# EAGLE board EEZ DIB DCP505 r1B2 (EAGLE 7.2.0), part 1 of 2
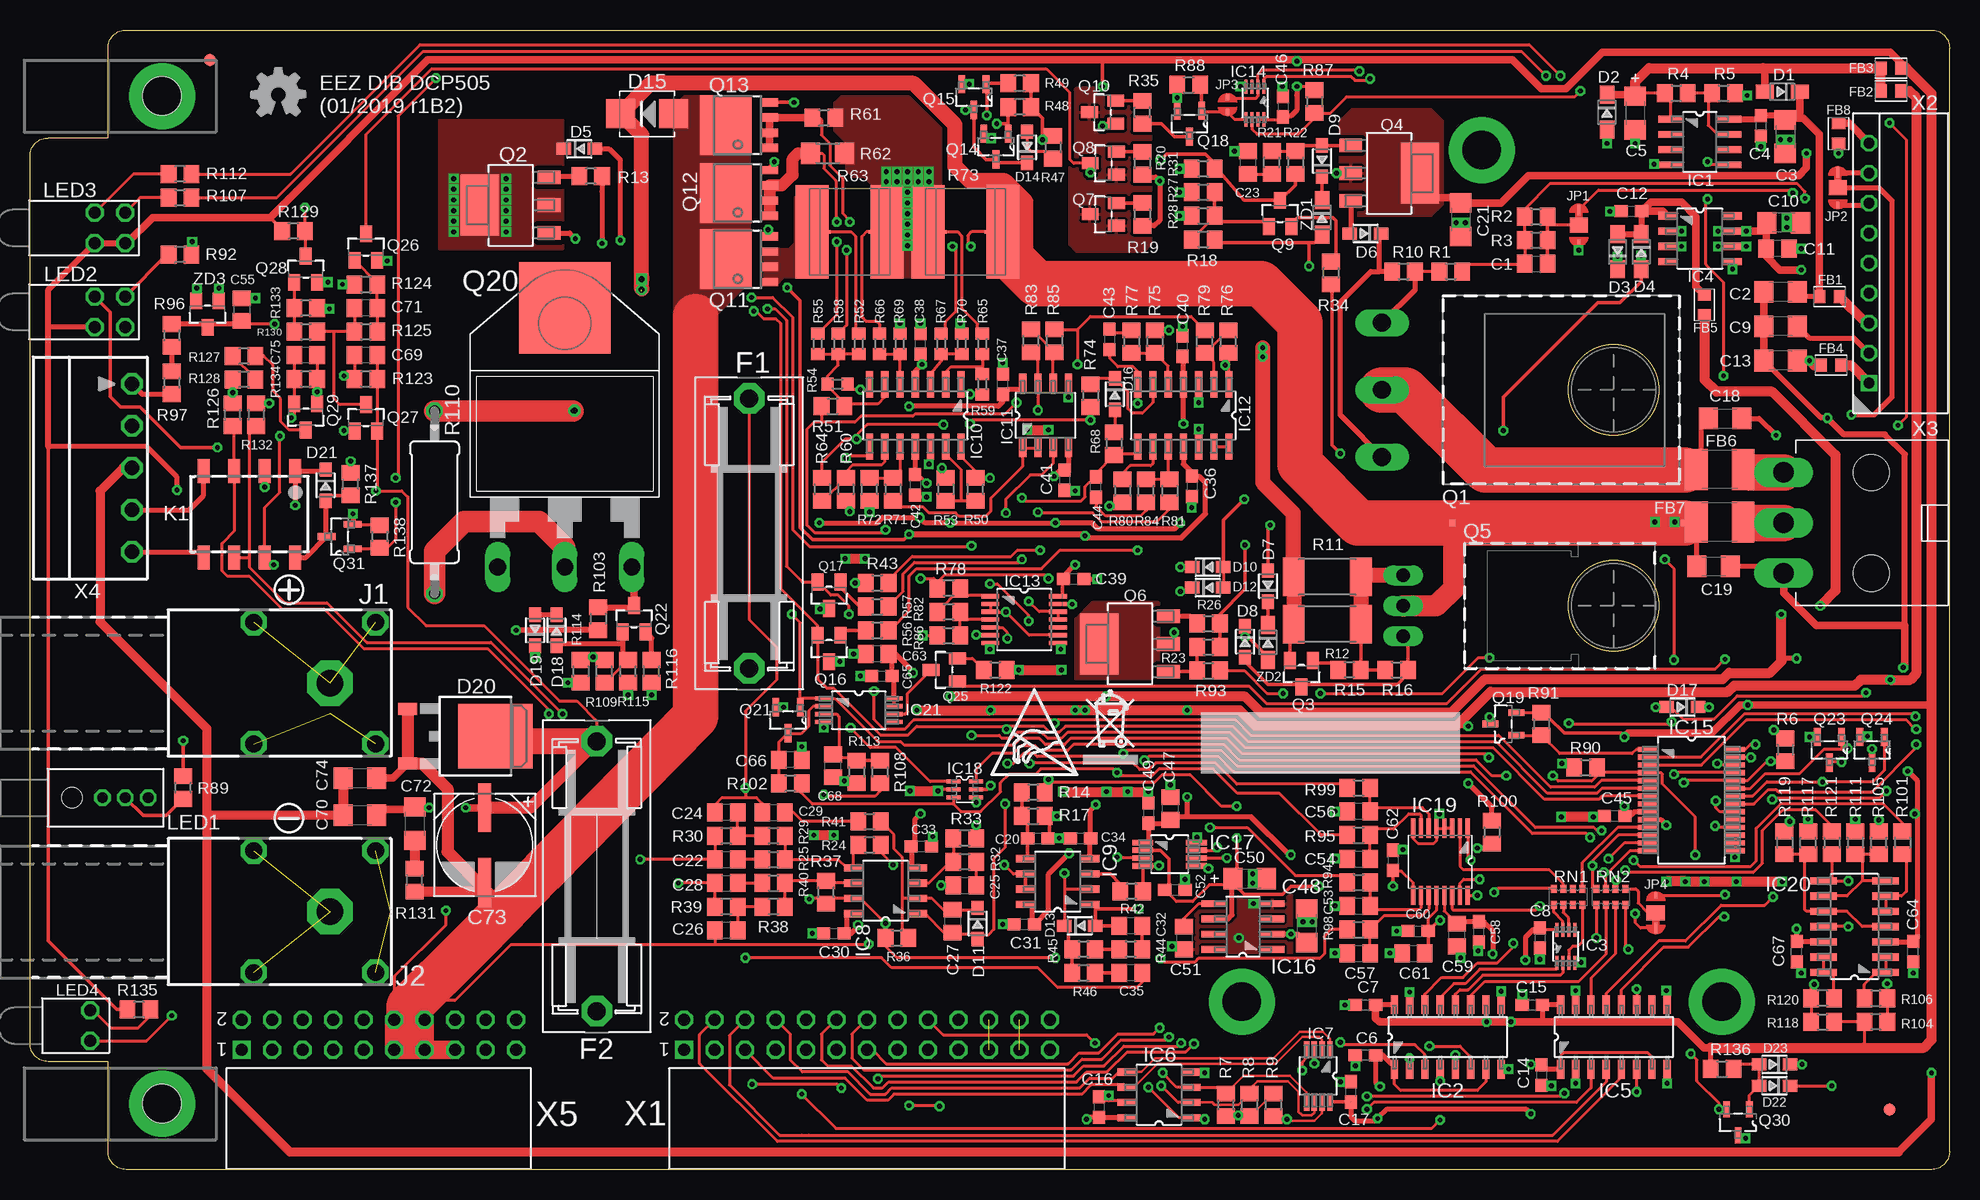
[diagram p6: board, top side]
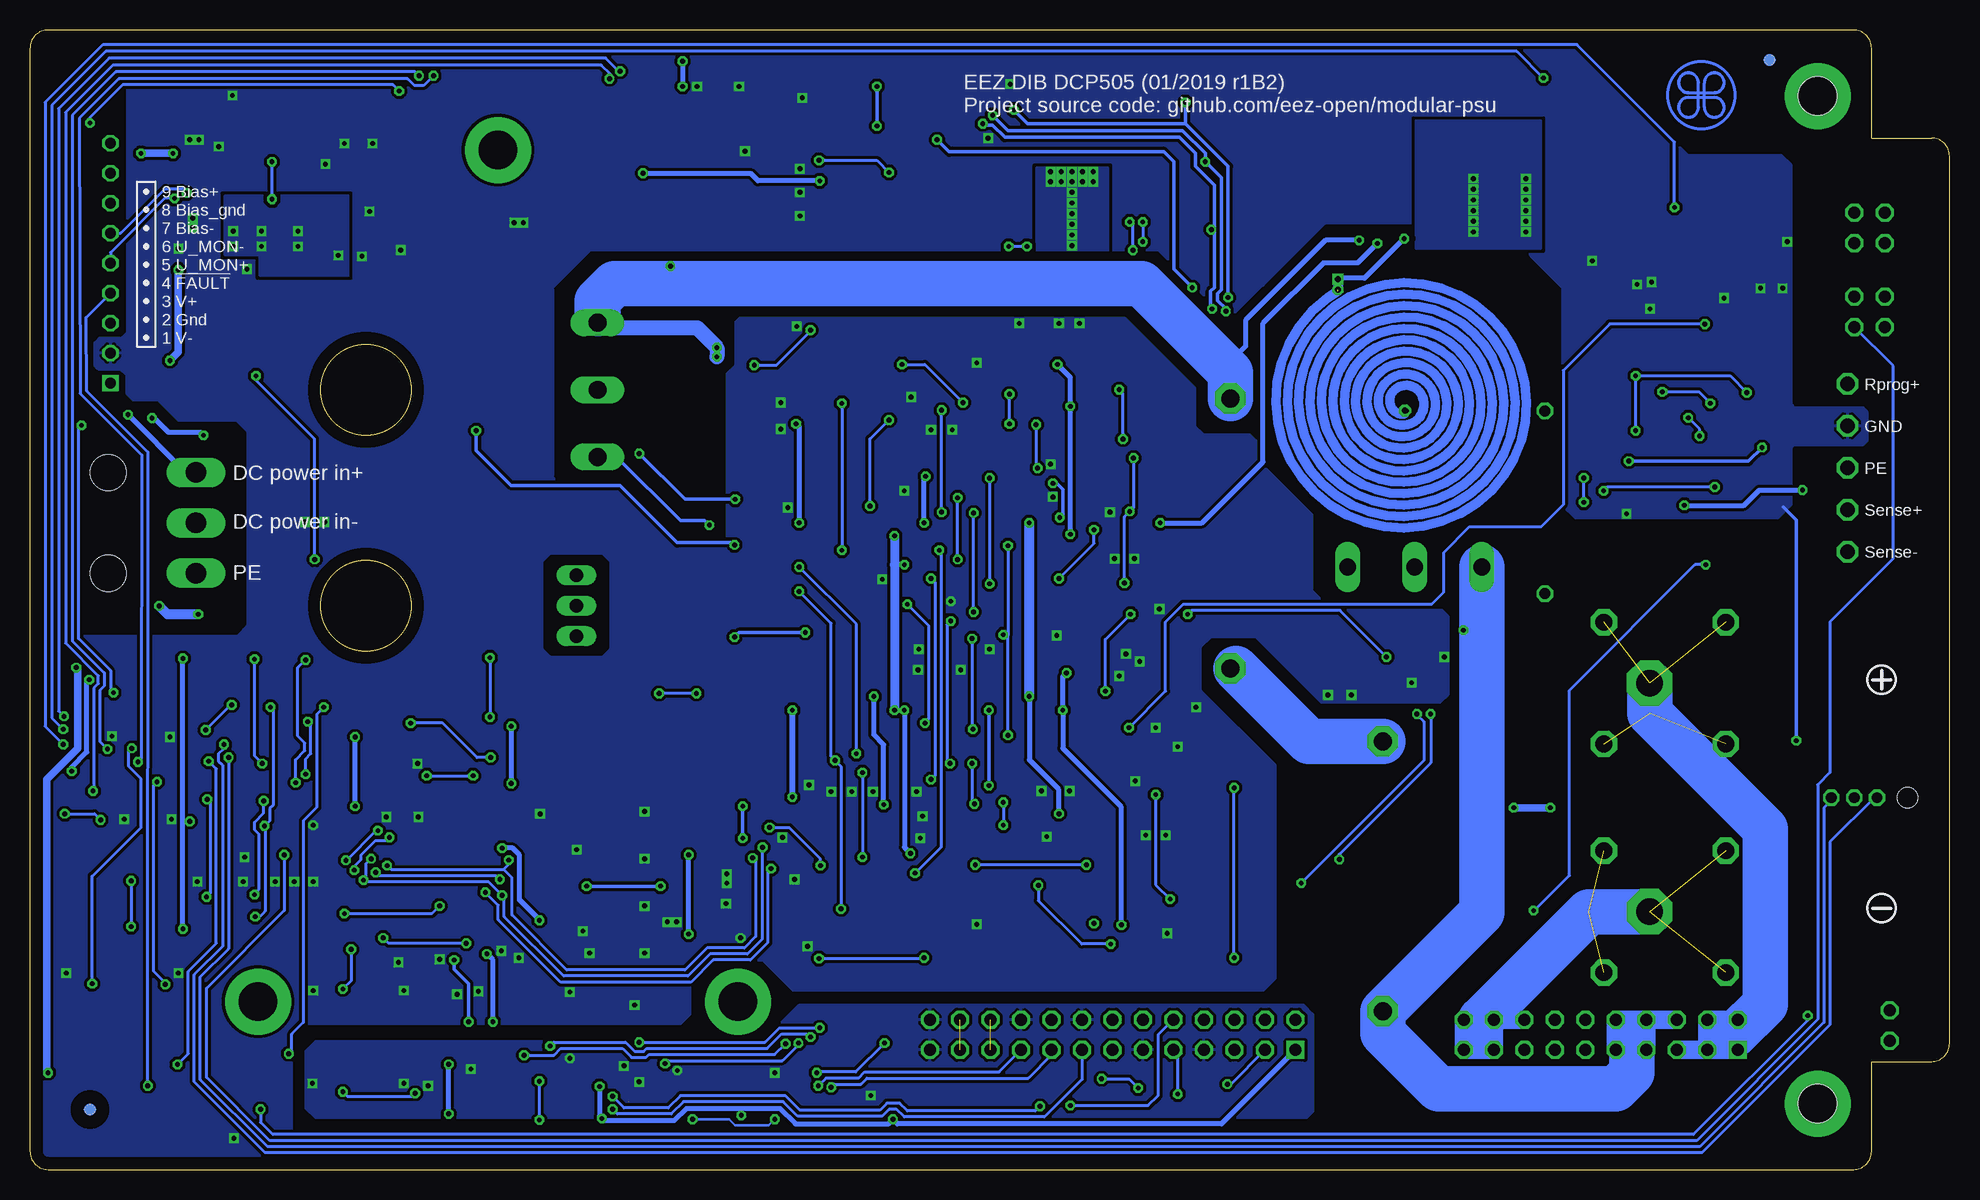
[diagram p7: board, bottom side, seen from below]

Size 160 x 95 mm. Coordinates in mm from the lower left corner, seen from the top.
Outline: 8,95 158.5,95 arc-90 160,93.5 160,1.5 arc-90 158.5,0 8,0 arc-90 6.5,1.5 6.5,9 1.5,9 arc-90 0,10.5 0,84.5 arc-90 1.5,86 6.5,86 6.5,93.5 arc-90 8,95
Outline: circle at 132,47 radius 3.75
Outline: circle at 132,65 radius 3.75
Copper layers (1*16): Top 0.035mm / dielectric 1.5mm / Bottom 0.035mm
Design rules "default *": minimum track width 6mil, minimum drill 0.3mm, track to track 6mil, track to pad 6mil, pad to pad 6mil, via to via 6mil, smd to smd 6mil, copper to edge 40mil, drill to drill 8mil, minimum pad ring 4mil, minimum via ring 8mil, stop-mask expansion 2.5mil, vias tented up to drill 1mm, thermal gap 8mil
Net classes: 0 default: width 0.203 mm, drill 0.3 mm, clearance 0.203 mm; 1 lvds: width 0.152 mm, drill 0.3 mm, clearance 0.152 mm to class 0, clearance 0.152 mm; 2 gnd: width 0.254 mm, drill 0.584 mm, clearance 0.254 mm

## Footprints (pad centres in the part's own frame; a part is rotated, then mirrored left to right if it is on the bottom)
C0805 = smd 1.3 x 1.5: 1 -0.95,0; 2 0.95,0
C1206 = smd 1.6 x 1.8: 1 -1.4,0; 2 1.4,0
C0603 = smd 1.1 x 1: 1 -0.85,0; 2 0.85,0
EC1206 = smd 1.6 x 1.8: + -1.4,0; - 1.4,0
CAPAE830X1050N = smd 4.064 x 1.092: + -3.124,0; - 3.124,0
SOD323-W = smd 1.5 x 1.2: A 1.45,0; C -1.45,0
SOD323-R = smd 1.2 x 1: A 1.3,0; C -1.3,0
SMB = smd 2.4 x 2.4: A 2.2,0; C -2.2,0
TO252-L = smd 1 x 1.6: 1 -2.28,-6.07; 2 2.28,-6.07 | smd 5.4 x 6.2: 3 0,1.23
ZH32 = drill 1.5 pad 2.54 octagon: 1 -11.25,0; 2 11.25,0
BEAD0603 = smd 1 x 1.1: P$1 -0.85,0; P$2 0.85,0
L1812 = smd 1.9 x 3.4: 1 -1.95,0; 2 1.95,0
FIDUCIAL_DUAL = smd 1.016 x 1.016 bottom: B 0,0 | smd 1.016 x 1.016: T 0,0
SOIC127P600X175-8N = smd 1.981 x 0.559: 1 -2.464,1.905; 2 -2.464,0.635; 3 -2.464,-0.635; 4 -2.464,-1.905; 5 2.464,-1.905; 6 2.464,-0.635; 7 2.464,0.635; 8 2.464,1.905
SOIC-16 = smd 1.549 x 0.61: 1 -2.692,4.445; 2 -2.692,3.175; 3 -2.692,1.905; 4 -2.692,0.635; 5 -2.692,-0.635; 6 -2.692,-1.905; 7 -2.692,-3.175; 8 -2.692,-4.445; 9 2.692,-4.445; 10 2.692,-3.175; 11 2.692,-1.905; 12 2.692,-0.635; 13 2.692,0.635; 14 2.692,1.905; 15 2.692,3.175; 16 2.692,4.445
DCU8 = smd 1.168 x 0.254: 1 -1.372,0.75; 2 -1.372,0.25; 3 -1.372,-0.25; 4 -1.372,-0.75; 5 1.372,-0.75; 6 1.372,-0.25; 7 1.372,0.25; 8 1.372,0.75
SOIC127P600X173-8N = smd 1.55 x 0.6: 1 -2.7,1.9; 2 -2.7,0.63; 3 -2.7,-0.64; 4 -2.7,-1.91; 5 2.7,-1.91; 6 2.7,-0.64; 7 2.7,0.63; 8 2.7,1.9
DGK8 = smd 1.422 x 0.432: 1 -2.184,0.965; 2 -2.184,0.33; 3 -2.184,-0.33; 4 -2.184,-0.965; 5 2.184,-0.965; 6 2.184,-0.33; 7 2.184,0.33; 8 2.184,0.965
SOIC127P600X175-14N = smd 2.2 x 0.6: 1 -2.591,3.81; 2 -2.591,2.54; 3 -2.591,1.27; 4 -2.591,0; 5 -2.591,-1.27; 6 -2.591,-2.54; 7 -2.591,-3.81; 8 2.591,-3.81; 9 2.591,-2.54; 10 2.591,-1.27; 11 2.591,0; 12 2.591,1.27; 13 2.591,2.54; 14 2.591,3.81
SOP65P640X120-14N = smd 1.473 x 0.356: 1 -2.819,1.956; 2 -2.819,1.295; 3 -2.819,0.66; 4 -2.819,0; 5 -2.819,-0.66; 6 -2.819,-1.295; 7 -2.819,-1.956; 8 2.819,-1.956; 9 2.819,-1.295; 10 2.819,-0.66; 11 2.819,0; 12 2.819,0.66; 13 2.819,1.295; 14 2.819,1.956
SOP65P780X200-28N = smd 1.651 x 0.432: 1 -3.632,4.216; 2 -3.632,3.581; 3 -3.632,2.921; 4 -3.632,2.286; 5 -3.632,1.626; 6 -3.632,0.965; 7 -3.632,0.33; 8 -3.632,-0.33; 9 -3.632,-0.965; 10 -3.632,-1.626; 11 -3.632,-2.286; 12 -3.632,-2.921; 13 -3.632,-3.581; 14 -3.632,-4.216; 15 3.632,-4.216; 16 3.632,-3.581; 17 3.632,-2.921; 18 3.632,-2.286; 19 3.632,-1.626; 20 3.632,-0.965; 21 3.632,-0.33; 22 3.632,0.33; 23 3.632,0.965; 24 3.632,1.626; 25 3.632,2.286; 26 3.632,2.921; 27 3.632,3.581; 28 3.632,4.216
DGK8-M = smd 1.727 x 0.483: 1 -2.235,0.965; 2 -2.235,0.33; 3 -2.235,-0.33; 4 -2.235,-0.965; 5 2.235,-0.965; 6 2.235,-0.33; 7 2.235,0.33; 8 2.235,0.965
SOT65P210X110-6N = smd 1.168 x 0.356: 1 -0.94,0.66; 2 -0.94,0; 3 -0.94,-0.66; 4 0.94,-0.66; 5 0.94,0; 6 0.94,0.66
PW(R-PDSO-G16) = smd 1.6 x 0.35: 1 -2.8,2.3; 2 -2.8,1.65; 3 -2.8,1; 4 -2.8,0.35; 5 -2.8,-0.3; 6 -2.8,-0.95; 7 -2.8,-1.6; 8 -2.8,-2.25; 9 2.8,-2.25; 10 2.8,-1.6; 11 2.8,-0.95; 12 2.8,-0.3; 13 2.8,0.35; 14 2.8,1; 15 2.8,1.65; 16 2.8,2.3
PW8_TSSOP8 = smd 1.473 x 0.356: 1 -2.921,0.975; 2 -2.921,0.325; 3 -2.921,-0.325; 4 -2.921,-0.975; 5 2.921,-0.975; 6 2.921,-0.325; 7 2.921,0.325; 8 2.921,0.975
S16N-PC = drill 2.2 pad 3.81 octagon: 1 0,0 | drill 1.4 pad 2.184 octagon: NC1 -3.8,5.08; NC2 -3.8,-5.08; NC3 6.36,5.08; NC4 6.36,-5.08
JP3-CUT = smd 1.27 x 1.524: COM 0,0 | smd 0.889 x 0.254: NC -1.27,0 | smd 0.508 x 0.254: NO 1.46,0
JP2-CUT = smd 0.508 x 0.254: 1 -0.635,0; 2 0.635,0
G6K-2F = smd 1 x 2: 1 -3.81,-3.6; 2 -1.27,-3.6; 3 1.27,-3.6; 4 3.81,-3.6; 5 3.81,3.6; 6 1.27,3.6; 7 -1.27,3.6; 8 -3.81,3.6
PCB-MB = hole 3.2: 0,0
L-42WUM-1EGWT = drill 0.9 octagon: CC 4.445,0; GREEN 6.35,0; RED 2.54,0 | hole 1.7: 0,0
L-934EB = drill 1 octagon: BA -1.27,-1.27; BC -1.27,1.27; TA 1.27,-1.27; TC 1.27,1.27
OSG8 = drill 1 octagon: A 0,1.27; C 0,-1.27
TO247BH-CLR2 = drill 1.499 long: 1 -5.588,-19.304; 2 0,-19.304; 3 5.588,-19.304
SOT230P700X180-4N = smd 1.905 x 1.143: 1 -3.2,2.311; 2 -3.2,0; 3 -3.2,-2.311 | smd 3.175 x 5.08: 4 2.565,0
SOT23-BEC = smd 1 x 1.4: B -0.95,-1.1; C 0,1.1; E 0.95,-1.1
TO220H-CLR2 = drill 1.118 long: 1 -2.54,-17.526; 2 0,-17.526; 3 2.54,-17.526
SOT669 = smd 0.7 x 1.4: 1 -1.905,-2.65; 2 -0.635,-2.65; 3 0.635,-2.65; 4 1.905,-2.65 | smd 5 x 4.3: MB 0,1
SOT103P240X110-3N = smd 1.524 x 0.559: 1 -1.079,1.016; 2 -1.079,-1.016; 3 1.079,0
SOT95P237X112-3N = smd 1.321 x 0.559: 1 -1.092,0.94; 2 -1.092,-0.94; 3 1.092,0
TOP3_TRIAC_NOHOLE = drill 1.397 long: A1 -5.588,-20.32; A2 0,-20.32; G 5.588,-20.32 | smd 7.62 x 7.62: NC 0,1.27
R0805 = smd 1.3 x 1.5: 1 -0.95,0; 2 0.95,0
R2512 = smd 1.8 x 3.2: 1 -2.8,0; 2 2.8,0
R0603 = smd 1 x 1.1: 1 -0.85,0; 2 0.85,0
R1206 = smd 1.6 x 1.803: 1 -1.422,0; 2 1.422,0
R_H2728 = smd 2.743 x 7.823: 1 -3.124,0; 2 3.124,0 | smd 0.508 x 0.254: 1S -1.841,0; 2S 1.841,0
0411/15 = drill 0.914 octagon: 1 -7.62,0; 2 7.62,0
CAY16 = smd 0.5 x 0.65: 1 -1.2,-0.675; 2 -0.4,-0.675; 3 0.4,-0.675; 4 1.2,-0.675; 5 1.2,0.675; 6 0.4,0.675; 7 -0.4,0.675; 8 -1.2,0.675
SHORT_NOHOLE = smd 0.5 x 0.25 bottom: P$1 0,0.117; P$2 0,-0.117
SSW-113-02-T-D-RA = drill 1 pad 1.5 square: 1 30.48,2.54 | drill 1 pad 1.5 octagon: 2 30.48,0; 3 27.94,2.54; 4 27.94,0; 5 25.4,2.54; 6 25.4,0; 7 22.86,2.54; 8 22.86,0; 9 20.32,2.54; 10 20.32,0; 11 17.78,2.54; 12 17.78,0; 13 15.24,2.54; 14 15.24,0; 15 12.7,2.54; 16 12.7,0; 17 10.16,2.54; 18 10.16,0; 19 7.62,2.54; 20 7.62,0; 21 5.08,2.54; 22 5.08,0; 23 2.54,2.54; 24 2.54,0; 25 0,2.54; 26 0,0
SPOX_22-05-7095 = drill 0.9 square: 1 -10,0 | drill 0.9 octagon: 2 -7.5,0; 3 -5,0; 4 -2.5,0; 5 0,0; 6 2.5,0; 7 5,0; 8 7.5,0; 9 10,0
MINIFIT_6659-3 = drill 1.7 long: 1 0,-4.2; 2 0,0; 3 0,4.2 | hole 3: -7.3,4.2; -7.3,-4.2
MC1,5/5-G-3,5 = drill 1.2 octagon: 1 -7,0; 2 -3.5,0; 3 0,0; 4 3.5,0; 5 7,0
SSW-110-02-T-D-RA = drill 1 pad 1.5 square: 1 22.86,2.54 | drill 1 pad 1.5 octagon: 2 22.86,0; 3 20.32,2.54; 4 20.32,0; 5 17.78,2.54; 6 17.78,0; 7 15.24,2.54; 8 15.24,0; 9 12.7,2.54; 10 12.7,0; 11 10.16,2.54; 12 10.16,0; 13 7.62,2.54; 14 7.62,0; 15 5.08,2.54; 16 5.08,0; 17 2.54,2.54; 18 2.54,0; 19 0,2.54; 20 0,0
SOT23 = smd 1 x 1.4: 1 -0.95,-1.1; 2 0.95,-1.1; 3 0,1.1

## Placement (x,y rotation side)
C1  47n  [C0805]  125.54,75.5 0 top
C2  47n  [C1206]  145.92,73.15 180 top
C3  10u  [C1206]  146.3,86.11 270 top
C4  100n  [C0603]  144.27,87 270 top
C5  4u7  [EC1206]  133.79,88.07 270 top
C6  100n  [C0603]  111.32,9.53 180 top
C7  100n  [C0603]  111.32,13.72 0 top
C8  100n  [C0603]  125.86,19.3 270 top
C9  47n  [C1206]  145.92,70.29 180 top
C10  10u  [C1206]  146.18,78.93 180 top
C11  470n  [C0805]  145.67,76.77 180 top
C12  100n  [C0603]  133.48,79.88 0 top
C13  47n  [C1206]  145.92,67.44 180 top
C14  100n  [C0603]  125.98,7.87 270 top
C15  100n  [C0603]  125.22,13.72 0 top
C16  100n  [C0603]  89.09,5.21 270 top
C17  100n  [C0603]  110.11,6.48 90 top
C18  47n  [C1206]  141.29,62.61 0 top
C19  47n  [C1206]  140.34,50.29 0 top
C20  100n  [C0603]  84.01,27.62 0 top
C21  1u/100V  [C1206]  119.25,79.18 270 top
C22  47p  [C0805]  58.04,25.84 0 top
C23  10n  [C0805]  101.54,83.95 90 top
C24  2n2  [C0805]  58.04,29.78 180 top
C25  2n2  [C0805]  77.91,23.69 0 top
C26  2n2  [C0805]  58.04,19.94 180 top
C27  220p  [C0805]  76.9,20.7 270 top
C28  47p  [C0805]  58.04,23.88 0 top
C29  2n2  [C0805]  61.98,29.78 0 top
C30  100n  [C0603]  66.99,19.68 0 top
C31  100n  [C0603]  82.87,20.45 0 top
C32  1n  [C0805]  91.76,20.32 180 top
C33  100n  [C0603]  74.3,26.92 180 top
C34  100n  [C0603]  87.57,27.62 0 top
C35  1n  [C0805]  91.76,16.38 180 top
C36  100n  [C0603]  96.84,56.96 270 top
C37  100n  [C0603]  81.09,65.47 90 top
C38  100n  [C0603]  74.23,68.83 90 top
C39  100n  [C0603]  87,49.21 180 top
C40  100n  [C0603]  96.08,68.64 90 top
C41  100n  [C0603]  86.23,57.47 270 top
C42  100n  [C0603]  73.79,57.09 270 top
C43  10n  [C0603]  89.98,69.22 270 top
C44  10n  [C0603]  88.84,56.9 90 top
C45  100n  [C0603]  132.08,29.46 180 top
C46  100n  [C0603]  104.42,88.61 270 top
C47  1u  [C0805]  95.06,30.1 90 top
C48  10u  [C1206]  106.43,20.32 90 top
C49  100n  [C0603]  93.22,29.72 270 top
C50  4u7  [EC1206]  101.66,24.26 0 top
C51  1u  [C0805]  96.2,19.3 270 top
C52  100n  [C0603]  95.44,23.3 180 top
C53  3n3  [C0805]  110.74,21.97 0 top
C54  3n3  [C0805]  110.74,25.91 0 top
C55  10n  [C0805]  17.65,71.69 270 top
C56  3n3  [C0805]  110.74,29.84 180 top
C57  3n3  [C0805]  110.74,18.03 0 top
C58  100n  [C0603]  120.78,19.81 90 top
C59  1u  [C0805]  118.94,19.56 90 top
C60  100n  [C0603]  115.7,19.88 0 top
C61  1u  [C0805]  115.32,18.03 0 top
C62  100n  [C0603]  113.6,25.78 270 top
C63  1u  [C0805]  70.61,42.99 180 top
C64  100n  [C0603]  156.97,18.16 90 top
C65  100n  [C0603]  70.99,41.15 0 top
C66  N.C.  [C0805]  63.37,34.16 180 top
C67  100n  [C0603]  147.26,18.16 90 top
C68  N.C.  [C0805]  66.93,33.66 90 top
C69  10n  [C0805]  28,67.88 180 top
C70  10n/200V  [C1206]  27.5,29.53 180 top
C71  2n2  [C0805]  28,71.82 180 top
C72  470n  [C1206]  32.07,28.83 270 top
C73  HHXC630ARA330MHA0G  [CAPAE830X1050N]  37.91,27.05 270 top
C74  10n/200V  [C1206]  27.5,32.64 0 top
C75  10n  [C0805]  22.99,67.88 180 top
D1  1N5819HW-7-F  [SOD323-W]  146.05,89.85 180 top
D2  1N5819HW-7-F  [SOD323-W]  131.44,88.14 270 top
D3  1N5819HW-7-F  [SOD323-W]  132.33,76.52 90 top
D4  1N5819HW-7-F  [SOD323-W]  134.3,76.52 270 top
D5  BAS316  [SOD323-R]  45.78,85.09 0 top
D6  BAS316  [SOD323-R]  111.32,78.04 180 top
D7  BAS316  [SOD323-R]  103.19,48.64 90 top
D8  BAS316  [SOD323-R]  101.28,44.01 270 top
D9  BAS316  [SOD323-R]  107.7,84.07 90 top
D10  BAS316  [SOD323-R]  98.17,50.23 0 top
D11  BAS316  [SOD323-R]  78.99,20.51 270 top
D12  BAS316  [SOD323-R]  98.17,48.51 0 top
D13  BAS316  [SOD323-R]  87.5,20.32 0 top
D14  BAS316  [SOD323-R]  83.12,85.22 90 top
D15  SK55  [SMB]  51.44,88.01 0 top
D16  BAS316  [SOD323-R]  90.42,64.64 270 top
D17  BAS316  [SOD323-R]  137.73,38.54 180 top
D18  BAS316  [SOD323-R]  43.88,44.96 270 top
D19  BAS316  [SOD323-R]  42.1,44.96 90 top
D20  SK10100D1-DIO  [TO252-L]  37.56,36.13 270 top
D21  BAS316  [SOD323-R]  24.64,57.05 270 top
D22  BAS316  [SOD323-R]  145.41,6.99 180 top
D23  BAS316  [SOD323-R]  145.41,8.76 180 top
EEZ_SIGNATURE  SIGNATURESMALL  [SIGNATURE_5MM]  20.68,89.58 180 top
F1  ZH32  [ZH32]  59.94,53.02 270 top
F2  ZH32  [ZH32]  47.24,24.45 270 top
FB1  BLM18AG102SH1D  [BEAD0603]  149.99,72.77 180 top
FB2  BLM18AG102SH1D  [BEAD0603]  155.13,89.92 0 top
FB3  BLM18AG102SH1D  [BEAD0603]  155.13,91.82 0 top
FB4  BLM18AG102SH1D  [BEAD0603]  150.11,67.06 180 top
FB5  BLM18AG102SH1D  [BEAD0603]  139.57,72.07 270 top
FB6  BLM41PG600SN1L  [L1812]  140.84,58.36 180 top
FB7  BLM41PG600SN1L  [L1812]  140.84,53.98 180 top
FB8  BLM18AG102SH1D  [BEAD0603]  150.75,86.36 270 top
FM1  FIDUCIAL_2  [FIDUCIAL_DUAL]  15,92.5 0 top
FM2  FIDUCIAL_2  [FIDUCIAL_DUAL]  155,5 0 top
IC1  LP2951  [SOIC127P600X175-8N]  139.19,85.66 0 top
IC2  SI8641BB-B-IS1  [SOIC-16]  118.17,11.05 90 top
IC3  SN74LVC1G139DCUR  [DCU8]  128.02,18.61 90 top
IC4  MC79L05  [SOIC127P600X173-8N]  139.19,77.6 0 top
IC5  SI8641BB-B-IS1  [SOIC-16]  132.02,11.05 90 top
IC6  AT24C04D-SSHM-T  [SOIC127P600X173-8N]  94.11,6.22 180 top
IC7  TMP1075AIDGK  [DGK8]  107.38,7.81 270 top
IC8  TL072D  [SOIC127P600X173-8N]  71.31,23.24 180 top
IC9  MC33274ADR2G  [SOIC127P600X173-8N]  85.66,24 180 top
IC10  OPA4197IDR  [SOIC127P600X175-14N]  73.79,62.87 270 top
IC11  MC33272ADR2G  [SOIC127P600X173-8N]  84.65,62.87 90 top
IC12  MC33274ADR2G  [SOIC127P600X175-14N]  96.14,62.87 270 top
IC13  74HC4066PW  [SOP65P640X120-14N]  82.87,45.85 0 top
IC14  74AUP1G74DC.125  [DCU8]  102.12,88.91 270 top
IC15  MCP23S17-E/SS  [SOP65P780X200-28N]  138.49,30.8 0 top
IC16  REF5025AIDR  [SOIC127P600X175-8N]  101.09,20.26 180 top
IC17  DAC8552IDGKR  [DGK8-M]  95,26.29 0 top
IC18  SN74LVC1G3157DCKR  [SOT65P210X110-6N]  77.91,31.69 0 top
IC19  ADS1120IPWR  [PW(R-PDSO-G16)]  117.54,25.65 270 top
IC20  LM339D  [SOIC127P600X175-14N]  152.08,20.26 180 top
IC21  LM211PWR  [PW8_TSSOP8]  69.09,38.29 0 top
J1  FCR7350R  [S16N-PC]  25,40.55 180 top
J2  FCR7350B  [S16N-PC]  25,21.5 180 top
JP1  JP3-CUT  [JP3-CUT]  129.1,78.74 270 top
JP2  JP3-CUT  [JP3-CUT]  150.69,81.85 270 top
JP3  JP2-CUT  [JP2-CUT]  99.82,88.77 270 top
JP4  JP3-CUT  [JP3-CUT]  135.51,21.4 90 top
K1  G6K-2F-5DC  [G6K-2F]  18.29,54.64 180 top
KK1  PCB-MB  [PCB-MB]  11,89.5 0 top
KK2  PCB-MB  [PCB-MB]  11,5.5 0 top
LED1  L-42WUM/1EGWT  [L-42WUM-1EGWT]  3.5,31 0 top
LED2  L-934EB/2ID  [L-934EB]  6.65,71.5 0 top
LED3  L-934EB/1Y1ID-RV  [L-934EB]  6.65,78.5 0 top
LED4  OSY5LU3E34X-3F1A  [OSG8]  5,12 0 top
Q1  IRFP250MPBF  [TO247BH-CLR2]  132,65 90 bottom
Q2  BCP56-16.115  [SOT230P700X180-4N]  40.07,80.39 180 top
Q3  BC856C  [SOT23-BEC]  105.98,41.34 180 top
Q4  BCP56-16.115  [SOT230P700X180-4N]  113.28,83.06 0 top
Q5  STF10P6F6  [TO220H-CLR2]  132,47 90 bottom
Q6  BCP56-16.115  [SOT230P700X180-4N]  91.69,43.81 180 top
Q7  MMBT5401  [SOT23-BEC]  89.47,79.63 90 top
Q8  MMBT5401  [SOT23-BEC]  89.47,83.88 90 top
Q9  MMBT5551  [SOT23-BEC]  104.2,79.69 0 top
Q10  MMBT5551  [SOT23-BEC]  89.41,88.14 90 top
Q11  PSMN0R9-25YLC  [SOT669]  58.99,75.88 90 top
Q12  PSMN0R9-25YLC  [SOT669]  58.99,81.41 90 top
Q13  PSMN0R9-25YLC  [SOT669]  58.99,87.06 90 top
Q14  2N7002  [SOT103P240X110-3N]  80.52,85.28 270 top
Q15  2N7002  [SOT103P240X110-3N]  78.68,89.41 270 top
Q16  MMBT5401  [SOT23-BEC]  66.61,43.43 180 top
Q17  MMBT5401  [SOT23-BEC]  66.61,47.88 180 top
Q18  2N7002  [SOT103P240X110-3N]  96.65,87.19 270 top
Q19  BSS84P  [SOT95P237X112-3N]  122.81,37.15 180 top
Q20  BTA26-600  [TOP3_TRIAC_NOHOLE]  44.58,70.55 0 top
Q21  2N7002  [SOT103P240X110-3N]  63.18,37.47 270 top
Q22  MMBT5551  [SOT23-BEC]  50.36,45.91 0 top
Q23  2N7002  [SOT103P240X110-3N]  149.99,34.99 270 top
Q24  2N7002  [SOT103P240X110-3N]  153.54,34.99 270 top
Q25  MMBT5551  [SOT23-BEC]  76.2,41.66 90 top
Q26  MMBT5551  [SOT23-BEC]  28,76.9 0 top
Q27  MMBT5401  [SOT23-BEC]  28,62.67 0 top
Q28  MMBT5551  [SOT23-BEC]  22.99,75.06 0 top
Q29  MMBT5551  [SOT23-BEC]  22.99,62.74 180 top
Q30  BSS84P  [SOT95P237X112-3N]  142.37,3.94 270 top
Q31  2N7002  [SOT103P240X110-3N]  25.81,52.77 180 top
R1  100K  [R0805]  118.43,74.87 0 top
R2  5K6  [R0805]  125.54,79.44 0 top
R3  82K  [R0805]  125.54,77.47 0 top
R4  16K  [R0805]  137.22,89.73 0 top
R5  5K1  [R0805]  141.16,89.73 0 top
R6  10K  [R0805]  146.3,34.99 270 top
R7  10K  [R0805]  99.69,5.4 90 top
R8  10K  [R0805]  101.66,5.4 90 top
R9  10K  [R0805]  103.63,5.4 270 top
R10  1K  [R0805]  114.49,74.87 0 top
R11  3R9/2W  [R2512]  108.14,49.41 180 top
R12  3R9/2W  [R2512]  108.14,45.47 180 top
R13  750R  [R0805]  46.74,82.8 180 top
R14  10K  [R0805]  83.63,31.43 180 top
R15  2K2  [R0805]  109.98,41.66 180 top
R16  2K2  [R0805]  113.92,41.66 0 top
R17  220R  [R0805]  83.63,29.46 0 top
R18  16K  [R0805]  97.79,77.53 0 top
R19  220R  [R0805]  92.71,79.63 270 top
R20  220R  [R0805]  92.71,83.88 270 top
R21  470R  [R0805]  103.5,83.95 90 top
R22  100R  [R0805]  105.47,83.95 270 top
R23  1K  [R0805]  98.23,43.56 0 top
R24  7K5 0.1%  [R0805]  69.98,27.05 180 top
R25  10K  [R0805]  61.98,25.84 0 top
R26  220R  [R0805]  98.23,45.53 0 top
R27  2K2  [R0805]  97.79,81.47 0 top
R28  750R  [R0805]  97.79,79.5 0 top
R29  130K 0.1%  [R0805]  61.98,27.81 180 top
R30  24K 0.1%  [R0805]  58.04,27.81 180 top
R31  51K  [R0805]  97.79,83.44 0 top
R32  220R  [R0805]  77.91,25.65 180 top
R33  10K  [R0805]  77.91,27.62 180 top
R34  470R  [R0805]  108.46,74.74 90 top
R35  1K8  [R0805]  92.71,88.14 90 top
R36  10K  [R0805]  72.26,19.3 0 top
R37  7K5 0.1%  [R0805]  66.36,23.11 90 top
R38  130K 0.1%  [R0805]  61.98,21.91 180 top
R39  24K 0.1%  [R0805]  58.04,21.91 180 top
R40  10K  [R0805]  61.98,23.88 0 top
R41  220R  [R0805]  69.98,29.02 0 top
R42  2K2  [R0805]  91.82,23.18 180 top
R43  10K  [R0805]  70.61,48.9 0 top
R44  1K  [R0805]  91.76,18.35 180 top
R45  10K  [R0805]  87.82,18.35 180 top
R46  10K  [R0805]  87.82,16.38 180 top
R47  1K  [R0805]  85.28,85.22 270 top
R48  1K  [R0805]  82.49,88.58 180 top
R49  1K  [R0805]  82.49,90.55 180 top
R50  30K  [R0805]  78.8,56.71 90 top
R51  7M5  [R0805]  66.93,63.63 0 top
R52  3K 0.1%  [R0603]  69.09,68.83 270 top
R53  10K  [R0805]  76.33,56.71 270 top
R54  40K2 0.1%  [R0603]  67.31,65.47 0 top
R55  3K 0.1%  [R0603]  65.66,68.83 270 top
R56  2K2  [R0805]  70.61,44.96 0 top
R57  2K2  [R0805]  70.61,46.93 0 top
R58  3K 0.1%  [R0603]  67.37,68.83 270 top
R59  499K 0.1%  [R0603]  79.38,65.47 90 top
R60  10K  [R0805]  68.01,56.71 270 top
R61  1R  [R0805]  66.17,87.69 0 top
R62  0R1  [R1206]  66.48,84.71 180 top
R63  0R010  [R_H2728]  68.33,78.17 180 top
R64  10K  [R0805]  66.04,56.71 270 top
R65  1K 0.1%  [R0603]  79.38,68.83 90 top
R66  1K 0.1%  [R0603]  70.8,68.83 270 top
R67  1K 0.1%  [R0603]  75.95,68.83 90 top
R68  1K  [R0805]  90.36,60.52 270 top
R69  40K2 0.1%  [R0603]  72.52,68.83 270 top
R70  499K 0.1%  [R0603]  77.66,68.83 90 top
R71  10K  [R0805]  71.95,56.71 270 top
R72  10K  [R0805]  69.98,56.71 90 top
R73  0R010  [R_H2728]  77.98,78.17 180 top
R74  10K  [R0805]  88.39,64.52 270 top
R75  100R  [R0805]  93.79,69.02 90 top
R76  1K  [R0805]  99.89,69.02 90 top
R77  10K  [R0805]  91.82,69.02 270 top
R78  1K  [R0805]  76.58,48.45 180 top
R79  10K  [R0805]  97.92,69.02 90 top
R80  10K  [R0805]  91.06,56.58 270 top
R81  100R  [R0805]  95,56.58 270 top
R82  1K  [R0805]  76.58,46.48 180 top
R83  10K  [R0805]  83.44,69.09 90 top
R84  10K  [R0805]  93.03,56.58 90 top
R85  10K  [R0805]  85.41,69.09 90 top
R86  1K  [R0805]  76.58,44.51 0 top
R87  10K  [R0805]  107.06,89.03 270 top
R88  100K  [R0805]  96.58,90.42 0 top
R89  270R  [R0805]  12.76,31.84 90 top
R90  47K  [R0805]  129.67,33.53 0 top
R91  100K  [R0805]  125.98,37.15 270 top
R92  470R  [R0805]  12.51,76.26 180 top
R93  10K  [R0805]  98.23,41.59 0 top
R94  220R  [R0805]  110.74,23.94 0 top
R95  220R  [R0805]  110.74,27.88 0 top
R96  470R  [R0805]  11.81,69.53 270 top
R97  470R  [R0805]  11.81,65.6 270 top
R98  220R  [R0805]  110.74,20 0 top
R99  220R  [R0805]  110.74,31.81 0 top
R100  10R  [R0805]  121.86,28.13 270 top
R101  10K  [R0805]  156.08,27.24 270 top
R102  10K  [R0805]  63.37,32.19 180 top
R103  470R  [R0805]  47.37,45.91 270 top
R104  5K1  [R0805]  153.86,12.32 180 top
R105  47K  [R0805]  154.11,27.24 90 top
R106  5K6  [R0805]  153.86,14.29 0 top
R107  330R  [R0805]  12.51,81.03 0 top
R108  750R  [R0805]  70.87,33.15 90 top
R109  1K  [R0805]  47.88,41.53 90 top
R110  AC01000001007JA100  [0411/15]  33.72,55.63 270 top
R111  2K2  [R0805]  152.15,27.24 270 top
R112  330R  [R0805]  12.51,82.99 180 top
R113  10K  [R0805]  68.9,33.15 270 top
R114  1K  [R0805]  45.91,41.53 270 top
R115  10K  [R0805]  49.85,41.53 90 top
R116  6R8  [R0805]  51.82,41.53 90 top
R117  10K  [R0805]  148.21,27.24 90 top
R118  5K1  [R0805]  149.42,12.32 0 top
R119  10K  [R0805]  146.24,27.24 270 top
R120  5K6  [R0805]  149.42,14.29 180 top
R121  10K  [R0805]  150.18,27.24 270 top
R122  1K  [R0805]  80.45,41.66 0 top
R123  330R  [R0805]  28,65.91 0 top
R124  47K  [R0805]  28,73.79 0 top
R125  47K  [R0805]  28,69.85 0 top
R126  750R  [R0805]  16.89,62.93 90 top
R127  1K  [R0805]  17.84,67.82 180 top
R128  2K2  [R0805]  17.84,65.85 180 top
R129  10K  [R0805]  21.97,78.23 180 top
R130  10K  [R0805]  22.99,69.85 0 top
R131  1R  [R0805]  32.07,24.13 90 top
R132  750R  [R0805]  18.86,62.93 270 top
R133  47K  [R0805]  22.99,71.82 180 top
R134  330R  [R0805]  22.99,65.91 0 top
R135  470R  [R0805]  9.08,13.34 180 top
R136  10K  [R0805]  141.03,8.38 0 top
R137  470R  [R0805]  26.73,57.15 90 top
R138  100K  [R0805]  29.15,52.77 270 top
RN1  DR1206-33R-4/8  [CAY16]  128.21,22.73 0 top
RN2  DR1206-33R-4/8  [CAY16]  131.76,22.73 0 top
SH1  [SHORT_NOHOLE]  118.55,53.91 90 bottom
SH2  [SHORT_NOHOLE]  137.79,53.91 90 bottom
U$1  [RECYCLE_BIN1/8]  87.76,33.78 0 top
U$6  [ESD_SYMBOL]  80.16,32.92 0 top
X1  ZL263-26DG  [SSW-113-02-T-D-RA]  85,12.5 180 top
X2  22-05-7085  [SPOX_22-05-7095]  153.29,75.56 90 top
X3  39-30-3035  [MINIFIT_6659-3]  146.18,53.91 180 top
X4  1844249  [MC1,5/5-G-3,5]  8.5,58.5 270 top
X5  ZL263-20DG  [SSW-110-02-T-D-RA]  40.5,12.5 180 top
ZD1  BZX384-C15  [SOD323-W]  107.7,79.38 270 top
ZD2  PDZ6.2B  [SOD323-W]  103.19,43.94 270 top
ZD3  SLVU2.8-TP  [SOT23]  14.8,71.31 180 top

## Tracks (layer width: path | path; a pad name or v marks a point on that pad's centre or on a via)
!DP_DRIVE
  Top 0.305: 96.84,43.56 R23.1 R93.1 97.2,41.5 Q6.1
  Top 0.406: 96.93,41.95 R93.1
!DRDY  (via drill 0.4)
  Top 0.254: IC19.14 118.54,21.73 118.62,21.65 125.54,21.65 v125.86,21.97 | v133.79,21.34 133.79,20.57 134.24,20.13 JP4.NC
  Bottom 0.254: v133.79,21.34 126.49,21.34 v125.86,21.97
!FAULT  (via drill 0.4)
  Top 0.254: D22.C v150.18,6.99
  Bottom 0.254: v150.18,6.99 150.24,7.05 150.18,59.82 155.26,64.9 155.32,71.03 X2.4
!FAULT_OUT  (via drill 0.4)
  Top 0.254: 141.43,4.65 Q30.2 140.79,5.03 | 140.79,5.03 v140.78,5.02 | 140.79,5.03 140.79,5.51 138.94,7.37 138.94,9.14 v138.43,9.65 | v129.22,89.92 128.71,89.41 109.73,89.41 108.4,88.08 R87.2 107.06,87.63 105.73,86.3 102.3,86.3 101.87,86.72 IC14.6 | v155,87.25 156.4,85.85 156.4,62.74 v155.7,62.04 | v153.03,39.75 152.78,39.5 142.3,39.5 140.34,37.53 137.79,37.53 136.78,38.54 D17.A v135.51,38.54 | LED4.C 9.71,10.73 v11.81,12.83
  Bottom 0.254: v11.81,12.83 11.81,12.45 21.34,2.92 139.76,2.92 140.78,3.94 v140.78,5.02 | v138.43,9.65 138.18,9.91 138.18,11.3 137.22,12.26 137.22,29.08 136.08,30.23 136.08,37.97 v135.51,38.54 | v129.22,89.92 129.73,90.42 152.27,90.42 155,87.69 v155,87.25 | v153.03,39.75 153.29,40.01 153.29,41.59 155.96,44.26 155.96,61.78 v155.7,62.04
!OVP_EN  (via drill 0.4)
  Top 0.254: IC15.26 140.78,33.72 v140.65,33.85 | v141.29,42.55 140.46,41.72 120.97,41.72 118.11,38.86 103.06,38.86 101.66,40.26 77.75,40.26 Q25.B
  Bottom 0.254: v141.29,42.55 141.29,34.48 v140.65,33.85
!RESET  (via drill 0.4)
  Top 0.254: IC15.18 140.59,28.51 v140.46,28.64 | IC5.12 132.65,14.99 136.21,18.54 138.24,18.54 140.78,21.08 v141.22,21.08 | D17.C v139.95,38.54
  Bottom 0.254: v141.22,21.08 140.84,21.08 140.4,21.53 140.4,28.57 v140.46,28.64 140.02,29.08 140.02,30.1 139.7,30.42 139.7,38.29 v139.95,38.54
!SET_DP
  Top 0.254: Q19.1 R91.2 | 126.15,36.03 R91.2 | IC15.1 133.88,35.01 133.54,34.67 127.51,34.67 R91.2
+3V3  (via drill 0.4)  (1 unrouted)
  Top 0.203: R8.1 101.73,4.45 R9.1
  Top 0.254: IC5.7 135.19,9.4 134.87,9.72 127.83,9.72 127.57,9.46 IC5.1 | 113.73,8.89 IC2.1 113.73,7.11 114.24,6.6 120.65,6.6 121.35,7.3 IC2.7 | R7.1 100.52,4.45 v100.71,4.51 100.9,4.45 R8.1
  Top 0.305: IC7.8 C17.1
  Top 0.406: IC5.1 126.03,8.36 C14.1 v125.09,8.76 | C16.2 89.13,4.6 | IC6.8 89.44,4.32 C16.2 | C6.1 112.33,9.53 | 113.73,8.89 113.67,8.83 113.47,8.83 112.78,9.53 C6.1 | C16.2 88.24,4.36 v88.08,4.19 | 112.2,9.36 C6.1 | v125.09,4.64 124.71,5.02 113.09,5.02 v112.33,4.25 112.14,4.06 110.43,4.06 110.11,4.38 C17.1 | C6.1 112.17,7.28 v112.52,6.92
  Bottom 0.254: v100.71,4.51 100.71,5.08
  Bottom 0.406: X1.1 60.67,3.81 87.69,3.81 v88.08,4.19 88.46,3.81 96.2,3.81 97.47,5.08 100.71,5.08 105.28,5.08 106.3,4.06 112.14,4.06 v112.33,4.25 112.52,4.45 v112.52,6.92 | v125.09,4.64 v125.09,8.76
+5V  (via drill 0.4)
  Top 0.254: C46.2 104.14,87.54 IC14.8 IC14.7 | IC5.10 135.19,12.38 135.25,12.32 | IC2.10 121.35,12.38 v121.41,12.32 | IC3.8 125.91,19.98 C8.1 | IC19.13 117.89,21.55 C59.2 | Q19.2 125.97,38.09 R91.1 126.43,37.66 126.49,37.66 | R118.2 R104.2 152.91,10.23 152.84,10.16 | 140.08,10.16 | R6.1 146.05,35.94 v145.35,36.64 | 105.6,89.53 | Q10.B 89.6,87.19 v89.41,87 | v105.6,90.3 106.74,90.3 R87.1
  Top 0.305: 1.52,60.26 1.52,19.05 7.24,13.34 R135.2 | R129.2 21.02,78.36 20,79.38 | v89.41,90.3 89.41,92.52 | v132.91,36.07 132.59,36.39 127.89,36.39 126.62,37.66 126.49,37.66
  Top 0.406: D21.C 24.52,58.24 K1.1 v22.1,55.37 | LED2.BA 1.59,70.23 1.52,70.29 | v12.26,56.64 12.26,57.72 9.72,60.26 1.52,60.26 | IC5.16 126.1,13.74 C15.2 126.07,12.41 125.98,12.32 | IC2.16 112.19,13.74 C7.2 | C46.2 104.42,87.82 105.09,87.82 105.6,88.33 105.6,89.53 v105.6,90.3 | 125.83,20 C8.1 | 125.91,19.98 125.26,19.98 124.65,19.37 v124.65,17.46 | v121.92,17.97 121.92,19.94 121.2,20.66 C58.2 119.09,20.66 C59.2 | v132.91,30.29 132.93,30.46 C45.1 133.22,29.34 133.72,29.83 IC15.9 | R136.1 140.08,10.16
  Top 0.508: 1.52,60.26 1.52,70.29 1.52,73.37 LED3.BA LED3.TA 8.08,77.23
  Top 0.61: 8.08,77.23 10.22,79.38 20,79.38 33.15,92.52 89.41,92.52 105.6,92.52 | C7.2 112.17,12.61 112.46,12.32 v121.41,12.32 v123.44,12.32 125.98,12.32 135.25,12.32 137.35,12.32 139.51,10.16 140.08,10.16 | 158.5,38.67 158.43,38.73 v143.19,38.73 142.56,38.73 140.21,36.39 133.22,36.39 v132.91,36.07 | FB3.P$2 155.98,92.24 155.07,93.15 131.06,93.15 128.02,90.11 125.98,90.11 123.57,92.52 105.6,92.52 | 105.6,92.52 v105.6,92.39
  Top 0.813: FB3.P$2 156.4,91.82 158.5,89.72 158.5,38.67 158.5,10.79 157.86,10.16 152.84,10.16 140.08,10.16
  Bottom 0.254: v143.19,38.73 143.26,38.73 v145.35,36.64
  Bottom 0.305: v89.41,87 v89.41,90.3 | v123.44,12.32 123.44,15.49 124.65,16.7 v124.65,17.46
  Bottom 0.406: v22.1,55.37 17.14,55.37 15.88,56.64 v12.26,56.64 | 121.67,17.72 v121.92,17.97 121.41,17.46 v121.41,12.32 | v132.91,30.29 v132.91,36.07 | v105.6,92.39 v105.6,90.3
+5VOUT
  Top 0.254: 134.24,89.41 134.56,89.72 R4.1 136.73,89.72 IC1.1
  Top 0.406: 134.24,89.41 133.86,89.41 C5.+
  Top 0.61: D2.C 133.68,89.59 C5.+ | D1.A 144.6,91.81 144.46,91.82
  Top 0.813: C5.+ 133.79,90.68 134.94,91.82 144.46,91.82 FB3.P$1 FB2.P$1
+6V
  Top 0.406: FB1.P$2 147.39,72.77 C2.1
  Top 0.508: 145.92,87.89 145.88,87.84 C4.1 | 144.18,87.76 C4.1 | IC1.8 143.99,87.57 C4.1
  Top 0.61: 147.57,87.63 147.83,87.63 149.14,86.32 FB1.P$2 | 147.57,87.63 146.43,87.63 C3.1 145.97,87.84 145.88,87.84 | D1.C 147.5,87.7 147.57,87.63
+VREF  (via drill 0.4)
  Top 0.254: IC19.9 115.25,22.89 115.25,23.94 114.33,24.87 113.67,24.87 C62.2 113.51,25.34 | 75.44,48.64 R78.2 75.63,48.96 | C52.2 95.54,22.35 96.9,22.35 98.3,23.75 100.39,23.75 | v100.58,30.29 99.31,30.29 96.71,32.89 94.36,32.89 93.73,32.26 85.15,32.26 v84.9,32.51 84.58,32.19 R14.1 | v71.31,53.34 71.06,53.09 65.41,53.09 64.77,53.72 64.77,61.72 65.34,62.29 66.04,62.29 | 75.63,48.96 76.26,49.59 84.58,49.59 v84.9,49.28 | v74.23,49.28 75.32,49.28 75.63,48.96 | v82.23,63.94 81.28,62.99 73.79,62.99 73.6,62.8 69.28,62.8 68.77,62.29 66.04,62.29 | 87.31,70.04 v87.31,67.12 | 87.31,70.04 88.39,71.12 96.77,71.12 R79.2 | R85.2 87.31,70.04 | R51.1 65.98,62.35 66.04,62.29
  Top 0.305: 100.14,24.45 100.39,24.19 100.39,23.94 100.39,23.75 101.22,22.92 104.39,22.92 105.09,23.62 v107.44,23.62 | v113.6,23.62 C62.2 | 94.74,23.3 C52.2 94.93,23.65 94.93,25.91 94.23,26.61 92.77,26.61 IC17.2 | C50.+ 100.39,24.26 100.58,24.45 v100.58,27.62
  Top 0.406: 100.39,23.94 C50.+ 100.2,24.2 100.2,21.21 99.89,20.89 IC16.6
  Bottom 0.254: v84.9,49.28 84.58,48.96 84.58,32.83 v84.9,32.51 | v74.23,49.28 71.31,52.2 v71.31,53.34 | v87.31,67.12 85.41,67.12 v82.23,63.94
  Bottom 0.305: v107.44,23.62 v113.6,23.62 | v100.58,27.62 v100.58,30.29
-5VOUT
  Top 0.508: D3.A D4.C 134.33,77.99 C12.2
  Top 0.61: IC4.1 136.11,79.88 C12.2 135.09,80.64 137.67,80.64 138.88,79.44 138.88,73.62 FB5.P$1
-9V  (via drill 0.4)
  Top 0.305: R23.2 99.18,43.25 | R23.2 99.31,43.56 | R26.2 99.18,45.72 99.25,45.78 | R26.2 R23.2 | D4.A 134.3,74.04 132.52,72.26 130.68,72.26 122.81,64.39 v122.81,61.59 | v101.28,52.07 101.28,48.39 99.19,46.29 R26.2
  Top 0.406: IC4.2 v137.66,78.23 v137.67,78.23 | IC4.3 v137.66,76.96 v137.67,76.96 | IC4.7 v140.72,78.23 | IC4.6 v140.72,76.96
  Top 0.508: v134.3,76.2 D4.A
  Top 0.61: v147.64,74.99 145.86,74.99 144.72,76.13 C11.2 144.72,78.3 | 144.72,78.3 144.72,78.87 C10.2 | v143.06,78.23 144.66,78.23 144.72,78.3
  Top 0.813: FB4.P$2 148.72,67.06 v148.34,67.44 C13.1
  Bottom 0.254: v137.67,78.23 137.86,78.23
  Bottom 0.305: v101.28,52.07 101.47,52.26 106.05,52.26 110.81,57.02 119.89,57.02 122.81,59.94 v122.81,61.59
  Bottom 0.61: v147.64,74.99 147.64,68.14 v148.34,67.44
  other vias: 143.07,76.96
  pour Bottom (isolate 0.305): 133.48,81.15 143.76,81.15 143.76,76.26 140.84,76.26 140.84,74.55 133.48,74.55
AUX_IN  (via drill 0.4)
  Top 0.254: v20.38,70.48 17.91,70.48 C55.2 | IC18.1 75.03,32.35 72.2,35.18 70.04,35.18 v68.39,36.83
  Top 0.406: C55.2 17.79,70.48 14.86,70.48 | 14.86,70.48 R96.1 | ZD3.3 14.86,70.27 14.86,70.48
  Bottom 0.254: v68.39,36.83 65.34,39.88 65.34,45.66 63.88,47.12 43.18,47.12 42.16,48.13 42.16,51.44 40.01,53.59 34.04,53.59 32.73,54.9 32.64,54.99 32.19,55.44 32.19,66.61 28.32,70.48 v20.38,70.48
AUX_USET_SW  (via drill 0.4)
  Top 0.254: v126.94,32.83 127.38,32.38 130.18,32.38 130.62,32.83 R90.2 131.06,33.08 IC15.4 135.95,33.08 136.08,32.96 136.08,32.13 138.81,29.4 v138.81,26.23 | v123.06,32.83 121.86,32.83 120.52,34.16 100.78,34.16 99.5,35.43 87,35.43 86.49,34.92 84.2,34.92 83.82,35.31 82.61,35.31 81.98,34.67 80.2,34.67 78.87,33.34 78.87,32.36 IC18.6 78.96,32.35
  Bottom 0.254: LED2.TA 4.7,67.01 4.7,50.93 9.97,45.66 9.97,33.08 10.99,32.07 10.99,12.51 21.08,2.41 140.02,2.41 145.29,7.68 145.29,15.11 138.81,21.59 v138.81,26.23 | v126.94,32.83 v123.06,32.83
BIAS_IN+
  Top 0.61: FB8.P$1 151.64,87.21 X2.9
CC_ACTIVE  (via drill 0.4)
  Top 0.254: R118.1 R120.2 148.47,15.18 v148.72,15.43 | Q24.1 154.56,33.27 153.61,32.32 v149.42,32.32 144.78,32.32 143.59,31.13 IC15.22
  Bottom 0.254: v148.72,15.43 148.72,15.56 149.67,16.51 149.67,32.07 v149.42,32.32
CC_LED
  Top 0.254: R112.2 8.6,83 LED3.BC
CCS_HS  (via drill 0.4)
  Top 0.406: Q2.2 44.03,80.45
  other vias: 35.31,81.72 35.31,80.84 35.31,78.17 39.69,81.72 35.31,82.61 35.31,79.95 35.31,79.06 39.69,80.84 39.69,82.61 39.69,79.95 39.69,79.06 39.69,78.17
  pour Top (isolate 0.406, no thermals): 44.45,76.77 44.45,87.44 34.1,87.44 34.1,76.77
  pour Bottom (isolate 0.508, no thermals): 44.45,76.77 44.45,87.44 34.1,87.44 34.1,76.77
CS_ADC
  Top 0.254: IC19.2 119.19,25.27 119.44,25.02 126.62,25.02 127.81,23.83 RN1.7
CS_DAC  (via drill 0.4)
  Top 0.254: IC17.5 97.99,25.32 v98.23,25.08 | RN1.8 127.01,23.43 122.36,23.43 v122.05,23.11
  Bottom 0.254: v98.23,25.08 98.49,24.83 98.49,18.92 99.95,17.46 103.06,17.46 104.9,15.62 115.76,15.62 120.97,20.83 120.97,22.04 v122.05,23.11
CS_IOEXP
  Top 0.254: IC15.11 132.33,28.51 129.41,25.58 RN1.5
CSA
  Top 0.254: IC3.1 127.27,16.71 127.25,16.7 120.84,16.7 119.63,15.49 118.68,15.49 117.6,14.41 117.6,13.8 IC2.13
CSB
  Top 0.254: IC2.12 118.81,14.61 119.19,14.99 119.89,14.99 121.09,16.19 127.57,16.19 127.77,16.39 IC3.2
CURR_5A  (via drill 0.4, 0.4 pad 0.41)
  Top 0.254: IC15.5 130.97,32.42 130.43,31.88 126.75,31.88 122.43,36.2 101.79,36.2 100.52,37.47 85.66,37.47 v85.41,37.21 85.15,37.47 73.66,37.47 72.9,36.7 71.18,36.7 70.36,37.53 v70.36,39.88 | v61.47,71.75 62.1,71.75 63.06,70.8 63.06,50.29 64.39,48.96 65.64,48.96 Q17.E 66.76,47.88 67.37,47.88 68.26,46.99 v68.26,46.29 | v86.87,47.12 85.71,47.12 IC13.13
  Top 0.305: 81.6,86.3 Q14.1 81.54,87.25 | R48.2 81.54,87.25 | v80.58,87.19 81.47,87.19 81.54,87.25 | Q17.E 65.79,48.45 | Q11.4 61.64,78.25 v61.53,78.36
  Bottom 0.254: v70.36,39.88 70.36,44.2 v68.26,46.29 | v86.87,47.12 85.09,45.34 85.09,37.53 v85.41,37.21
  Bottom 0.305: v80.58,87.19 80.45,87.06 79.76,87.06 78.74,86.04 64.2,86.04 62.87,84.71 62.87,83.63 61.28,82.04 61.28,78.61 v61.53,78.36 61.28,78.11 61.28,73.53 61.59,73.22 61.59,71.82 61.53,71.75 v61.47,71.75
CURR_50MA  (via drill 0.4)
  Top 0.254: IC15.7 131.08,31.13 130.81,30.86 126.24,30.86 121.92,35.18 101.28,35.18 100.01,36.45 86.49,36.45 85.98,35.94 84.84,35.94 84.33,36.45 82.3,36.45 81.79,35.94 81.03,35.94 80.77,36.2 v78.49,36.2 | IC13.6 79.88,44.58 v78.87,44.58 | v60.13,72.71 61.91,72.71 63.56,71.06 63.56,53.34 64.96,51.94 78.42,51.94 v78.49,52.01
  Top 0.305: D14.C 80.8,83.92 Q14.3 79.69,84.2 78.68,85.22 Q15.3 v77.98,88.33 | Q13.4 v63.69,88.96
  Bottom 0.254: v78.49,36.2 78.49,44.51 | v78.49,52.01 78.49,44.51 | v78.87,44.58 78.55,44.58 78.49,44.51
  Bottom 0.305: 63.69,87.19 60.13,83.63 v60.13,72.71 | 63.69,87.19 v63.69,88.96 | 63.69,87.19 76.83,87.19 v77.98,88.33
CURR_500MA  (via drill 0.4)
  Top 0.254: IC15.6 131.01,31.76 130.62,31.37 126.49,31.37 122.17,35.69 101.54,35.69 100.27,36.96 86.3,36.96 85.79,36.45 85.03,36.45 84.52,36.96 81.66,36.96 v81.41,36.7 81.15,36.96 73.91,36.96 73.15,36.2 70.93,36.2 66.99,40.13 66.42,40.13 65.66,40.89 Q16.E 65.66,45.34 62.55,48.45 62.55,70.55 62.17,70.93 61.15,70.93 60.52,71.56 v60.33,71.56 | v81.47,44.26 81.47,44.77 81.09,45.15 80.09,45.15 IC13.5
  Top 0.305: v79.76,87.88 79.76,90.42 Q15.1 79.76,90.55 R49.2 | 62.04,83.33 Q12.4 61.64,83.61 v62.04,84.01
  Bottom 0.254: v81.47,44.26 81.47,36.77 v81.41,36.7
  Bottom 0.305: v60.33,71.56 60.33,71.75 61.02,72.45 61.02,73.03 60.71,73.34 60.71,82.68 v62.04,84.01 62.04,84.71 63.94,86.61 78.49,86.61 v79.76,87.88
CV_ACTIVE  (via drill 0.4)
  Top 0.254: R104.1 R106.2 v154.81,15.49 | IC15.23 143.4,31.76 144.65,33.02 147.51,33.02 149.54,35.05 151,35.05 | 151,35.05 151.45,35.05 v151.51,35.12 | Q23.1 151,35.05
  Bottom 0.254: v154.81,15.49 154.81,24.45 150.75,28.51 150.75,32.58 151.76,33.59 151.76,34.86 v151.51,35.12
CV_LED
  Top 0.254: R107.1 9.18,81.03 LED3.TC
DC_BIAS  (via drill 0.4)
  Top 0.406: Q4.2 v108.9,83.06 | R19.2 93.73,78.68 94.17,79.12 v94.17,82.42 93.85,82.74 92.9,82.74 R20.2 | C21.1 119.25,80.96 119.32,81.03
  Top 0.61: C21.1 119.38,80.58 122.62,80.58 124.9,82.87 147.45,82.87 148.08,83.5 v148.08,84.71 | 119.32,81.03 116.84,81.03 | FB8.P$2 v150.75,84.71
  Bottom 0.406: v108.9,83.06 99.95,83.06 99.31,82.42 v94.17,82.42
  Bottom 0.61: v150.75,84.71 v148.08,84.71
  pour Top (isolate 0.305): 110.17,88.39 116.78,88.39 117.73,87.44 117.73,80.45 116.78,79.5 109.22,79.5 109.22,87.44
DIB_5V  (1 unrouted)
DIB_12V  (1 unrouted)
DIB_A0  (via drill 0.4)
  Top 0.203: R9.2 104.52,4.45 v104.78,4.19 104.9,4.06 107.06,4.06 107.7,4.7 107.7,5.61 IC7.7 | IC6.1 97.78,4.32 v97.92,4.19
  Top 0.254: IC6.1 95.75,4.32 v93.22,6.86
  Bottom 0.203: v104.78,4.19 101.73,4.19 101.22,3.68 98.42,3.68 v97.92,4.19
  Bottom 0.254: X1.17 74.84,9.55 76.77,7.62 90.23,7.62 90.74,7.11 92.96,7.11 v93.22,6.86
DIB_A1  (via drill 0.4)
  Top 0.203: IC6.2 98.55,5.59 98.74,5.4 100.71,5.4 R8.2 101.66,6.73 102.3,7.37 104.84,7.37 105.73,6.48 105.73,4.83 106.05,4.51 106.81,4.51 107.05,4.75 IC7.6
  Top 0.254: IC6.2 95.69,5.59 v94.3,6.99
  Bottom 0.254: X1.19 79.21,8.13 90.42,8.13 90.93,7.62 93.66,7.62 v94.3,6.99
DIB_A2  (via drill 0.4)
  Top 0.203: IC7.5 106.41,6.43 105.03,7.81 101.16,7.81 R7.2
  Top 0.254: R7.2 99.69,6.86 IC6.3 95.56,6.86 94.42,8 v94.42,8.06 | X1.18 76.1,11.24 88.08,11.24 v88.77,10.54
  Bottom 0.254: v88.77,10.54 91.19,8.13 94.36,8.13 v94.42,8.06
DIB_CSA  (via drill 0.4)
  Top 0.254: v117.54,7.37 IC2.4 | v117.54,4.13 116.84,3.43 67.18,3.43 v64.33,6.29
  Bottom 0.254: v117.54,4.13 v117.54,7.37 | v64.33,6.29 64.33,9.61 X1.9
DIB_CSB  (via drill 0.4)
  Top 0.203: IC2.5 v118.81,9.53
  Top 0.254: X1.12 67.17,12.5 65.98,11.3 65.98,9.14 66.48,8.64 68.45,8.64 70.29,6.79 71.06,6.79 71.56,7.3 87.25,7.3 88.08,8.13 89.79,8.13 91.44,9.78 96.33,9.78 v97.03,10.48
  Bottom 0.254: v118.81,9.53 116.33,9.53 115.76,10.1 110.62,10.1 109.86,9.34 108.65,9.34 108.39,9.59 97.92,9.59 v97.03,10.48
DIB_IRQ  (via drill 0.4)
  Top 0.254: v133.92,6.48 IC5.6 | v127.89,6.35 127.89,6.1 v111.44,6.1 | v73.28,5.33 75.75,5.33 v75.82,5.27
  Bottom 0.254: v133.92,6.48 133.54,6.1 128.08,6.1 v127.89,6.35 | X1.10 64.72,12.5 65.98,11.24 65.98,6.16 66.8,5.33 v73.28,5.33 | v111.44,6.1 110.49,5.14 106.81,5.14 105.79,6.16 97.03,6.16 95.82,4.95 89.15,4.95 88.58,5.52 87.5,5.52 86.87,4.89 76.2,4.89 v75.82,5.27
DIB_MISO  (via drill 0.4)
  Top 0.254: X1.14 69.71,12.5 68.52,11.3 68.52,9.27 69.47,8.32 86.81,8.32 87.69,9.21 89.34,9.21 90.93,10.79 94.68,10.79 v94.93,11.05 | v116.65,10.29 119.19,10.29 120.08,9.4 IC2.6
  Bottom 0.254: v116.65,10.29 116.33,10.6 110.36,10.6 109.6,9.84 108.84,9.84 108.58,10.1 98.55,10.1 97.35,11.3 95.25,11.3 v94.93,11.05
DIB_MOSI  (via drill 0.4)
  Top 0.254: IC5.3 130.11,6.79 128.91,5.59 112.01,5.59 v111.44,5.02
  Bottom 0.254: X1.15 72.3,7.52 75.44,4.38 87.12,4.38 87.76,5.02 88.39,5.02 88.96,4.45 96.01,4.45 97.22,5.65 105.54,5.65 106.55,4.64 111.06,4.64 v111.44,5.02
DIB_NFAULT  (via drill 0.4)
  Top 0.254: v60.2,7.11 67.31,7.11 v67.63,6.79 | IC7.3 107.05,8.84 v107.06,8.83 | v70.67,7.56 70.93,7.81 87,7.81 87.82,8.64 89.53,8.64 91.19,10.29 95.69,10.29 v95.95,10.54
  Bottom 0.254: v60.2,7.11 59.91,7.11 X1.3 | 67.88,7.05 v67.63,6.79 68.39,7.56 v70.67,7.56 | v95.95,10.54 95.95,10.41 97.28,9.08 106.81,9.08 v107.06,8.83
DIB_NRESET
  Top 0.254: IC5.5 132.65,7.68 127.32,2.35 62.29,2.35 55.82,8.83 55.82,11.26 X1.4
DIB_SCL
  Top 0.203: 107.82,9.78 107.71,9.89 IC7.2 107.7,10.01 107.7,10.79 107.44,11.05 106.05,11.05 103.82,8.83 93.98,8.83 92.02,6.86 IC6.6
  Top 0.254: IC6.6 91.22,7.05 88.46,7.05 87.69,6.29 72.01,6.29 71.5,5.78 69.79,5.78 67.94,7.62 61.94,7.62 X1.5
DIB_SCLK  (via drill 0.4)
  Top 0.254: IC2.3 116.27,9.59 115.44,10.41 109.41,10.41 v109.22,10.6 | X1.13 70.24,9.96 71.37,8.83 86.55,8.83 87.44,9.72 89.09,9.72 90.68,11.3 93.66,11.3 v94.17,11.81
  Bottom 0.254: v109.22,10.6 98.74,10.6 97.54,11.81 v94.17,11.81
DIB_SDA
  Top 0.203: IC7.1 108.34,10.91 107.76,11.49 105.86,11.49 103.63,9.27 93.79,9.27 92.65,8.13 IC6.5
  Top 0.254: IC6.5 91.35,8.19 90.81,8.19 90.23,7.62 88.33,7.62 87.5,6.79 71.82,6.79 71.31,6.29 70.04,6.29 68.2,8.13 64.39,8.13 63.37,9.14 63.37,11.3 62.18,12.5 X1.8
DP_LED  (via drill 0.4)
  Top 0.254: v104.46,39.69 103.12,39.69 101.22,41.59 R93.2 | v107.57,39.69 117.73,39.69 120.71,42.67 v121.67,42.67 | v121.67,37.72 121.67,37.2 Q19.3
  Bottom 0.254: v104.46,39.69 v107.57,39.69 | v121.67,42.67 v121.67,37.72
DP_S
  Top 0.305: R12.1 110.94,41.73 R15.1 R16.1
  Top 1.27: R11.1 R12.1 | 110.98,49.56 R11.1 | Q5.3 111.08,49.54 R11.1
GCOM  (via drill 0.4)
  Top 0.254: IC9.6 81.97,24.64 v81.22,25.4 | R24.1 70.93,26.42 v71.94,25.4
  Top 0.305: IC9.6 IC9.7
  Bottom 0.254: v71.94,25.4 v81.22,25.4
GND  (via drill 0.4)
  Top 0.254: C33.1 v75.25,27.75 | C62.1 v114.43,26.67 | C60.1 v113.92,19.88 | v113.35,18.03 C61.1 | C54.1 v108.78,25.91 | C53.1 v108.78,21.97 | C57.1 v108.78,18.03 | C56.2 v108.78,29.84 | IC19.8 115.29,27.59 115.7,27.18 117,27.18 117.24,27.41 IC19.5 | 117.86,28.42 IC19.4 | IC19.3 IC19.4 | IC19.5 IC19.4 | IC19.5 117.24,29.42 v117.47,29.65 | Q31.2 29.08,53.78 | v24.83,73.98 23.96,73.98 Q28.E | v24.96,71.75 R133.1 | v18.8,72.64 C55.1 | IC14.4 100.91,90.28 v100.9,90.3 | v104.39,90.3 104.37,89.47 C46.1 | C30.1 v65.22,19.68 | v64.33,35.24 C66.1 | R113.2 68.07,32.2 v67.88,32.38 67.56,32.7 C68.1 | v115,14.8 IC2.15 | IC5.9 136.49,13.72 136.49,14.83 v136.4,14.92 | v122.62,14.86 122.66,13.78 IC2.9 | Q26.E 29,75.75 v29.78,75.75 | R124.1 v26.04,73.79 | IC18.2 75.82,31.69 v75.69,31.56 | v96.27,24.19 96.27,23.33 C52.1 | C59.1 v119.25,17.65 | C58.1 v120.71,18.22 | v129.29,17.27 128.8,17.27 IC3.4 | v153.16,36.13 Q24.2 | v148.34,36.07 Q23.2 | v143,2.6 142.61,2.6 Q30.3 | 131.17,29.27 C45.2 131.38,29.19 v130.3,29.4 | IC15.17 IC15.16 IC15.15 142.13,26.05 v142.11,26.04 | R111.1 v152.15,29.21 | R117.2 v148.21,29.21 | v97.28,27.69 97.28,27.3 IC17.8 | v127.7,33.85 128.4,33.85 R90.1 | v96.08,70.29 C40.2 | IC12.3 v97.41,63.94 | v97.41,61.72 IC12.12 | v74.23,70.55 C38.2 | v74.93,58.8 IC10.12 | v85.92,43.37 85.47,43.89 IC13.8 | R69.1 v72.52,70.55 | v77.53,70.55 77.53,69.81 R70.2 | R72.1 v69.98,54.8 | Q17.C 65.89,46.78 v65.85,46.74 | C23.2 v100.39,84.9 | R114.2 45.02,40.45 v44.83,40.58 | 73.83,56.07 C42.2 | 79.87,43.88 IC13.7 80.01,43.85 v80.01,43.37 | IC11.5 v86.56,64.39 v86.55,64.39 | C37.2 v81.09,67.25 | v96.84,55.18 C36.2 | C41.2 v87.12,56.58 | Q16.C 67.48,42.33 v67.5,42.35 | v74.42,44.51 R86.1
  Top 0.254: v83.25,47.37 84.11,46.51 IC13.12 IC13.11
  Top 0.305: R89.2 v12.76,35.75 | ZD3.1 v15.74,73.47 v15.75,73.47 | ZD3.2 13.85,73.41 v13.91,73.47 | v13.53,77.34 13.53,76.33 R92.1 | R27.1 v95.82,81.47 | R28.1 v95.82,79.5 | Q18.2 v95.63,89.34 95.63,88.84 R88.1 | IC21.4 v66.17,36.83 | C63.2 v68.64,42.99 | C65.1 v69.22,41.15 | R122.2 v82.42,41.66 | C31.1 v81.09,20.45 | C34.1 v85.79,27.62 | v85.6,29.46 R17.2 84.96,29.21 84.96,27.73 C20.2 | v49.85,39.56 R115.1 | 51.75,40.52 R116.1 v51.82,39.56 | JP1.NO v129.09,76.64 | v80.14,85.98 79.88,85.98 Q14.2 | v78.3,90.49 Q15.2 | v74.74,56.07 73.95,56.07 C42.2 | v95.82,83.44 R31.1
  Top 0.406: 29.08,53.78 R138.1 | C5.- v133.79,85.53 | D2.A v131.44,85.53 | v26.92,54.67 26.92,53.82 Q31.2 | v62.8,38.54 Q21.2 | v128.84,14.92 IC5.15 | v124.4,14.61 124.4,13.8 C15.1 | C47.2 v95.06,32.07 | C49.1 v93.22,31.5 | IC16.4 v101.98,22.16 | C50.- 102.11,24.26 v101.92,23.88 | C48.2 106.43,20.95 v106.11,20.64 | C51.2 v95.19,18.61 | C7.1 v109.6,13.72 | C8.2 v125.86,17.53 | C64.1 v156.97,16.38 | C67.1 v147.64,16.38 | IC15.10 135.93,29.17 v136.4,28.7 | SH2.P$2 v137.1,53.98 | C9.1 148.3,69.31 152.04,69.31 X2.2 | v135.38,83.82 136.66,83.82 IC1.4 | D19.C v42.1,42.74 | C39.1 v88.96,49.21
  Top 0.508: C4.2 v144.27,85.28 | C12.1 v131.7,79.88 | IC4.5 141.89,75.09 v141.92,75.06
  Top 0.61: v145.92,85.85 145.92,85.09 C3.2 | v146.43,78.55 147.39,78.55 C10.1 | C11.1 v147.64,76.77 | 147.19,70.29 C9.1 | v143.13,89.53 R5.2 | v132.33,76.14 D3.C | v118.87,78.93 118.87,78.1 C21.2
  Top 0.813: v86.11,31.5 v89.72,31.5 v91.5,31.5 v93.22,31.5 | v146.05,24 v137.99,24 v136.4,24 | v130.3,29.4 v127.64,29.4 | v73.34,31.56 v75.69,31.56 | v65.34,27.88 v66.99,27.88 | v83.12,61.66 v84.9,61.66 | v67.94,50.93 v69.6,50.93 | v82.42,41.66 v85.98,41.66
  Bottom 0.305: v12.76,35.75 12.76,54.17 13.84,55.24
  Bottom 0.406: v137.1,53.98 137.03,53.91
  other vias: 146.69,85.85 146.43,79.31 119.63,78.93 106.87,20.64 101.92,24.64 100.77,19.3 142.24,24 135.45,53.98 139.57,24
  pour Top: 96.52,22.86 105.16,22.86 105.16,18.03 96.52,18.03
  pour Bottom (isolate 0.254, rank 2): 13.97,84.52 21.78,84.52 32.26,95 151.89,95 151.89,69.79 152.4,69.28 154.24,69.28 154.62,68.9 154.62,67.06 154.31,66.74 152.46,66.74 151.96,66.23 151.96,64.71 151.45,64.2 149.35,64.2 147.64,62.48 142.81,62.48 141.86,61.53 141.86,45.34 142.75,44.45 159.83,44.45 159.83,0.13 138.18,0.13 138.18,11.3 137.29,12.19 105.73,12.19 104.97,12.95 104.97,15.56 103.06,17.46 98.93,17.46 96.46,14.99 57.15,14.99 56.2,15.94 56.2,33.72 62.42,39.94 62.42,43.56 61.53,44.45 57.85,44.45 52.39,38.99 42.42,38.99 41.78,39.62 41.78,46.1 42.29,46.61 51.5,46.61 53.15,48.26 53.15,54.61 57.21,58.67 57.21,60.83 57.98,61.59 61.28,61.59 61.66,61.98 61.66,69.34 57.28,73.72 57.21,73.72 52.01,78.93 37.66,78.93 32.26,73.53 32.26,55.37 31.24,54.36 14.29,54.36 13.21,55.44 13.21,60.2 12.95,60.45 7.18,60.45 6.86,60.77 6.86,63.18 7.18,63.5 12.95,63.5 13.21,63.75 13.21,83.76
GNDIO  (via drill 0.4)
  Top 0.254: IC5.2 v128.84,7.18 | v126.81,6.99 C14.2 | 89,6.29 C16.1 89.43,5.71 89.92,5.71 | v106.05,8.26 106.05,8.95 106.43,9.34 106.43,9.98 IC7.4 | IC6.7 91.41,5.62 91.5,5.71 89.92,5.71 | v89.92,6.16 89.92,5.71 | C6.2 110.47,8.66 v110.49,8.64 | IC6.4 97.86,8.13 v97.92,8.06
  Top 0.305: v109.22,7.3 110.08,7.3 C17.2
  Top 0.406: IC5.8 v136.46,7.18 | IC2.8 v123.25,8.38 | IC2.2 v115,9.27
  pour Bottom (isolate 0.254): 53.85,13.72 53.09,12.95 53.09,4.83 53.59,4.32 136.21,4.32 136.97,5.08 136.97,9.91 136.21,10.67 98.93,10.67 95.89,13.72
HOLE_DL  (via drill 3.2 pad 5.5)
  other vias: 11,5.5
HOLE_DL2  (via drill 3.2 pad 5.5)
  other vias: 101,14
HOLE_DL3  (via drill 3.2 pad 5.5)
  other vias: 141,14
HOLE_UL  (via drill 3.2 pad 5.5)
  other vias: 11,89.5
HOLE_UL2  (via drill 3.2 pad 5.5)
  other vias: 121,85
I_CTRL  (via drill 0.4)
  Top 0.254: IC10.8 69.96,60.26 69.96,59.55 69.91,59.5 68.2,59.5 v68.01,59.31 | R43.1 v68.77,48.9 | R60.2 68.01,55.18 v68.33,54.86
  Bottom 0.254: v68.77,48.9 68.77,54.42 v68.33,54.86 68.01,55.18 v68.01,59.31
I_MON  (via drill 0.4)
  Top 0.254: R99.1 109.73,31.81 109.41,32.13 100.58,32.13 98.81,33.91 93.85,33.91 93.28,33.34 92.52,33.34 91.95,33.91 83.38,33.91 v83.31,33.85 | v80.01,48.83 80.64,48.83 83.25,46.23 v83.25,45.72 | R50.2 78.8,58.23 77.6,59.44
  Top 0.305: 77.6,59.44 IC10.14 | R50.2 v80.01,57.66
  Bottom 0.254: v80.01,57.66 v80.01,48.83 | v83.25,45.72 83.57,45.4 83.57,34.1 v83.31,33.85
I_SERVO  (via drill 0.4)
  Top 0.254: C32.2 | 150.18,28.57 R121.1 150.18,28.64 148.84,29.97 146.11,29.97 144.4,28.26 144.4,25.53 143.64,24.77 133.16,24.77 v132.97,24.96 | v130.05,27.69 129.73,28 125.22,28 120.08,33.15 100.33,33.15 99.06,34.42 93.22,34.42 v92.9,34.1 | v95.89,48.2 96.55,48.2 D12.C
  Top 0.305: C32.2 D13.A 88.8,21.78 | 88.8,21.78 88.8,22 88.9,22.1 IC9.1 | v92.39,21.72 88.87,21.72 88.8,21.78
  Bottom 0.254: v92.39,21.72 92.39,33.59 v92.9,34.1 93.22,34.42 93.22,45.53 v95.89,48.2 | v132.97,24.96 132.97,25.27 132.4,25.84 132.4,26.23 131.19,27.43 130.3,27.43 v130.05,27.69
I_SET  (via drill 0.4)
  Top 0.254: IC17.4 94.09,25.32 v94.11,25.34 | v98.36,28.51 101.47,28.51 105.47,24.51 109.22,24.51 R94.1
  Top 0.305: IC17.4 92.76,23.06 R42.1
  Bottom 0.254: v98.36,28.51 96.71,28.51 94.11,25.91 v94.11,25.34
IRQ
  Top 0.254: 132.96,23.31 RN2.5 133.82,23.41 134.05,23.18 134.05,22.23 134.87,21.4 JP4.COM
ISENSE+
  Top 0.254: IC10.6 71.25,64.39 70.67,63.82 68.07,63.82 R51.2 67.88,63.88 66.46,65.3 R54.1 66.46,66.14 67.37,67.06 R58.2 | R52.2 R58.2 | R55.2 R58.2
ISENSE-
  Top 0.254: IC10.5 R69.2 R66.2
KNOCKOUT
  cutout Bottom: 102.11,52.51 102.11,66.42 101.41,67.12 101.41,70.74 100.9,71.25 68.71,71.25 62.67,65.21 62.67,62.04 62.17,61.53 58.29,61.53 57.15,60.39 57.28,67.69 65.98,76.39 113.28,76.39 116.2,73.47 116.2,57.78 115.7,57.28 110.68,57.28 105.92,52.51
  cutout Bottom: 111.82,43.5 111.82,50.61 112.33,51.12 116.59,51.12 117.09,50.61 117.09,43.5 116.59,42.99 112.33,42.99
LOOP_CTRL  (via drill 0.4)
  Top 0.254: D10.A D12.A
  Top 0.305: v109.22,59.69 108.52,60.39 108.52,72.96 R34.1 | 99.6,48.39 D12.A | D10.A 99.47,54.13 v101.22,55.88
  Bottom 0.305: v101.22,55.88 105.41,55.88 v109.22,59.69
MISO  (via drill 0.4)
  Top 0.254: IC19.15 119.19,23.88 119.51,24.19 v120.84,24.19 | RN2.7 131.36,24.62 v131.19,24.77 131.57,24.77 133.35,26.54 134.82,26.54 IC15.14 134.89,26.61
  Bottom 0.254: v131.19,24.77 131.25,24.51 121.16,24.51 v120.84,24.19
MOSI  (via drill 0.4)
  Top 0.254: IC17.7 98.69,26.62 v98.93,26.86 | IC19.16 120.33,22.85 v120.65,22.86 | RN2.6 132.16,24.09 v132.21,24.13 | IC15.13 132.88,27.22 v131.57,25.91
  Bottom 0.254: v98.93,26.86 99,26.8 99,19.18 100.2,17.97 103.31,17.97 105.16,16.13 115.51,16.13 120.46,21.08 120.46,22.67 v120.65,22.86 121.79,24 132.08,24 v132.21,24.13 132.02,24.32 132.02,25.46 v131.57,25.91
N$1
  Top 0.254: R73.2S 77.34,78.17 77.66,77.85 77.66,71.82 78.99,70.48 78.99,69.72 79.03,69.68 R65.2
N$2
  Top 0.813: FB1.P$1 151.56,72.05 151.76,71.84 153.04,70.56 X2.3
N$3  (via drill 0.4)
  Top 0.254: 142.11,29.84 IC15.20 140.86,29.83 140.53,30.16 v140.53,30.73 | JP4.NO 141.22,22.86 v141.29,22.92
  Bottom 0.254: v140.53,30.73 140.53,29.72 141.29,28.96 141.29,28.32 140.91,27.94 140.91,23.37 141.29,22.99 v141.29,22.92
N$4  (via drill 0.4)
  Top 0.254: C69.1 R123.2 Q27.E 28.95,56.7 v28.83,56.58 30.99,56.58 31.5,56.07 31.5,46.86 33.02,45.34 37.85,45.34 44.13,39.05 45.59,39.05 47.24,37.4 F2.1 | v19.56,56.9 K1.2 | F2.1 47.24,35.24 47.12,35.12 47.12,35.57 F2.1
  Top 0.61: C70.1 28.89,29.85 29.08,30.04 31.87,30.04 C72.1 | 32.12,30.18 33.26,30.18 v33.27,30.16 | v36.32,30.16 37.9,30.16 C73.+
  Top 1.016: 37.91,34.66 38.94,35.7 | C73.+ 41.72,30.18 F2.1 | 32.12,30.18 C72.1
  Top 2.184: F2.1 38.94,35.7 D20.3
  Bottom 0.254: v19.56,56.9 28.51,56.9 v28.83,56.58 | 59.49,41.77 F1.2
  Bottom 0.61: v33.27,30.16 v36.32,30.16
  Bottom 3.81: F2.1 53.41,35.7 59.49,41.77
N$5
  Top 0.813: FB4.P$1 151.8,67.06 X2.1
N$6
  Top 0.254: IC3.7 127.77,20.7 127,21.46 RN1.1
N$7  (via drill 0.4)
  other vias: 73.15,77.03 73.15,77.91 73.15,78.8 73.15,79.69 73.15,80.58 73.15,81.47 73.15,82.36 74.04,82.36 74.93,82.36 72.26,82.36 71.37,82.36 71.37,83.19 72.26,83.19 73.15,83.19 74.04,83.19 74.93,83.19
  pour Top (isolate 0.305, no thermals): 70.23,74.42 75.95,74.42 75.95,86.87 73.41,89.41 67.56,89.41 67.06,88.9 67.06,86.61 68.07,85.6 68.07,83.31 68.58,82.8 69.47,82.8 70.23,82.04
  pour Bottom (isolate 0.305, no thermals): 70.17,76.33 76.07,76.33 76.07,83.5 70.17,83.5
N$8
  Top 0.254: IC11.2 IC11.1 82.72,60.13 82.72,58.59 80.07,55.94 80.07,54.86 79.69,54.48 77.41,54.48 77.15,54.74 74.93,54.74 74.42,55.24 72.46,55.24 R71.2
N$9
  Top 0.254: IC2.11 120.08,14.48 121.28,15.68 129.09,15.68 131.36,17.95 RN2.2
N$10  (via drill 0.4)
  Top 0.254: RN2.4 132.96,18.61 v133.22,18.35 | v133.92,15.05 IC5.11
  Bottom 0.254: v133.22,18.35 133.22,15.75 v133.92,15.05
N$11
  Top 0.406: FB7.1 143.45,53.98 143.51,53.91
  Top 3.048: X3.2 143.51,53.91
N$12
  Top 0.305: R89.1 12.73,30.89 11.37,29.53 9.42,29.53 LED1.CC
N$13
  Top 0.254: JP1.COM 126.55,78.74 126.49,78.8
  Top 0.305: R2.2 126.49,78.8 R3.2 C1.2
N$14
  Top 0.254: R136.2 142.36,8.76 D23.A D22.A 143.31,6.18 Q30.1
N$15